# EAGLE design LTC1514 (3V3 pompa) (EAGLE 6.3)
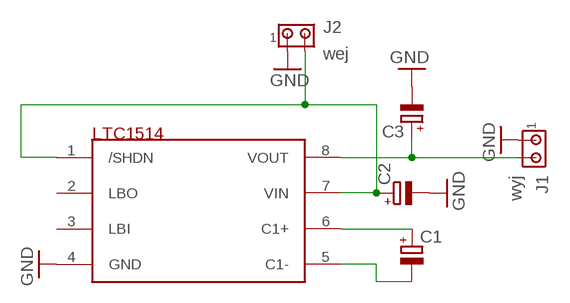
[diagram p0: schematic, sheet 1]

## Parts
C1  CPOL-EUE2,5-6E  [E2,5-6E]
C2  CPOL-EUE2,5-6E  [E2,5-6E]
C3  CPOL-EUE2,5-6E  [E2,5-6E]
J1  wyj  MTA02-100  [10X02MTA]
J2  wej  MTA02-100  [10X02MTA]
U$1  LTC1514  [SO08]

## Nets
GND: C2.- C3.- J1.1 J2.1 U$1.4(GND)
N$1: C2.+ J2.2 U$1.1(/SHDN) U$1.7(VIN)
N$2: C1.+ U$1.6(C1+)
N$3: C1.- U$1.5(C1-)
N$4: C3.+ J1.2 U$1.8(VOUT)
Unconnected: U$1.2(LBO) U$1.3(LBI)

## Library data of the parts
C1-C3 = rcl:CPOL-EU: POLARIZED CAPACITOR, European symbol
J1 J2 = con-amp:MTA02-100: AMP connector
U$1 = ref-packages:LTC1514

## Net classes
0 default: clearance 0.7 mm

## Board
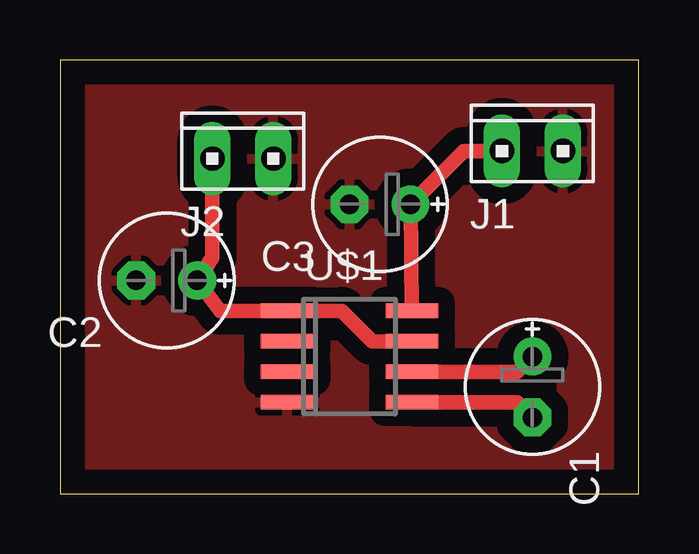
[diagram p1: board, top side]

Size 24.11 x 18.09 mm. Coordinates in mm from the lower left corner, seen from the top.
Outline: 0,0 24.11,0 24.11,18.09 0,18.09 0,0
Copper layers (1*16): Top 0.035mm / dielectric 1.5mm / Bottom 0.035mm
Design rules "default": minimum track width 10mil, minimum drill 24mil, track to track 8mil, track to pad 8mil, pad to pad 8mil, via to via 8mil, smd to smd 8mil, copper to edge 40mil, drill to drill 8mil, minimum pad ring 10mil, minimum via ring 8mil, stop-mask expansion 4mil, vias tented up to drill 0mil, thermal gap 10mil

### Footprints (pad centres in the part's own frame; a part is rotated, then mirrored left to right if it is on the bottom)
E2,5-6E = drill 0.813 pad 1.575: + -1.27,0 | drill 0.813 pad 1.575 octagon: - 1.27,0
10X02MTA = drill 1.016 long: 1 1.27,0; 2 -1.27,0
SO08 = smd 0.6 x 2.2: 1 -1.905,-2.6; 2 -0.635,-2.6; 3 0.635,-2.6; 4 1.905,-2.6; 5 1.905,2.6; 6 0.635,2.6; 7 -0.635,2.6; 8 -1.905,2.6

### Placement (x,y rotation side)
C1  19.68,4.44 270 top
C2  4.45,8.89 180 top
C3  13.34,12.06 180 top
J1  19.68,14.29 0 top
J2  7.62,13.97 0 top
U$1  12.06,5.71 270 top

### Tracks (layer width: path | path; a pad name or v marks a point on that pad's centre or on a via)
GND
  pour Top: -0.64,-1.91 32.39,-1.91 34.93,0.63 34.93,23.49 -1.91,23.49 -5.71,19.69 -5.71,3.17
N$1
  Top 0.61: J2.2 6.35,9.84 C2.+ 6.67,7.62 U$1.1 11.75,7.62 13.02,6.35 U$1.7
N$2
  Top 0.61: U$1.6 19.05,5.08 C1.+
N$3
  Top 0.61: U$1.5 19.05,3.81 C1.-
N$4
  Top 0.61: U$1.8 C3.+ 16.83,14.29 J1.2